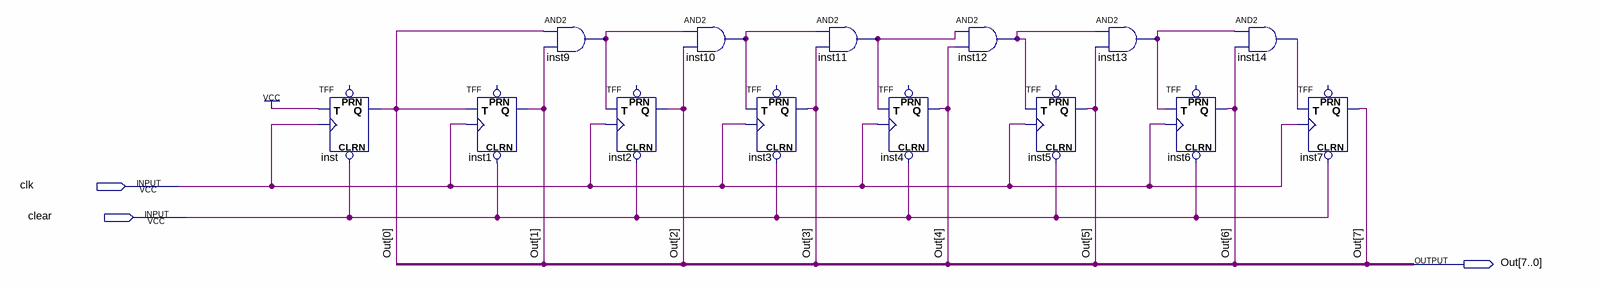
[diagram p0: schematic sheet]
// Quartus schematic contador.bdf as structural Verilog: 14 symbols, 3 pins
module contador (
  input  clk,
  input  clear,
  output [7:0] Out
);

  wire inst9_out, inst10_out, inst11_out, inst12_out, inst13_out, inst14_out;

  TFF inst (.CLRN(clear), .T(1'b1), .CLK(clk), .Q(Out[0]));  // open: PRN
  TFF inst1 (.CLRN(clear), .T(Out[0]), .CLK(clk), .Q(Out[1]));  // open: PRN
  and inst9 (inst9_out, Out[0], Out[1]);
  TFF inst2 (.CLRN(clear), .T(inst9_out), .CLK(clk), .Q(Out[2]));  // open: PRN
  and inst10 (inst10_out, inst9_out, Out[2]);
  TFF inst3 (.CLRN(clear), .T(inst10_out), .CLK(clk), .Q(Out[3]));  // open: PRN
  and inst11 (inst11_out, inst10_out, Out[3]);
  TFF inst4 (.CLRN(clear), .T(inst11_out), .CLK(clk), .Q(Out[4]));  // open: PRN
  and inst12 (inst12_out, inst11_out, Out[4]);
  TFF inst5 (.CLRN(clear), .T(inst12_out), .CLK(clk), .Q(Out[5]));  // open: PRN
  and inst13 (inst13_out, inst12_out, Out[5]);
  TFF inst6 (.CLRN(clear), .T(inst13_out), .CLK(clk), .Q(Out[6]));  // open: PRN
  and inst14 (inst14_out, inst13_out, Out[6]);
  TFF inst7 (.CLRN(clear), .T(inst14_out), .CLK(clk), .Q(Out[7]));  // open: PRN
endmodule
